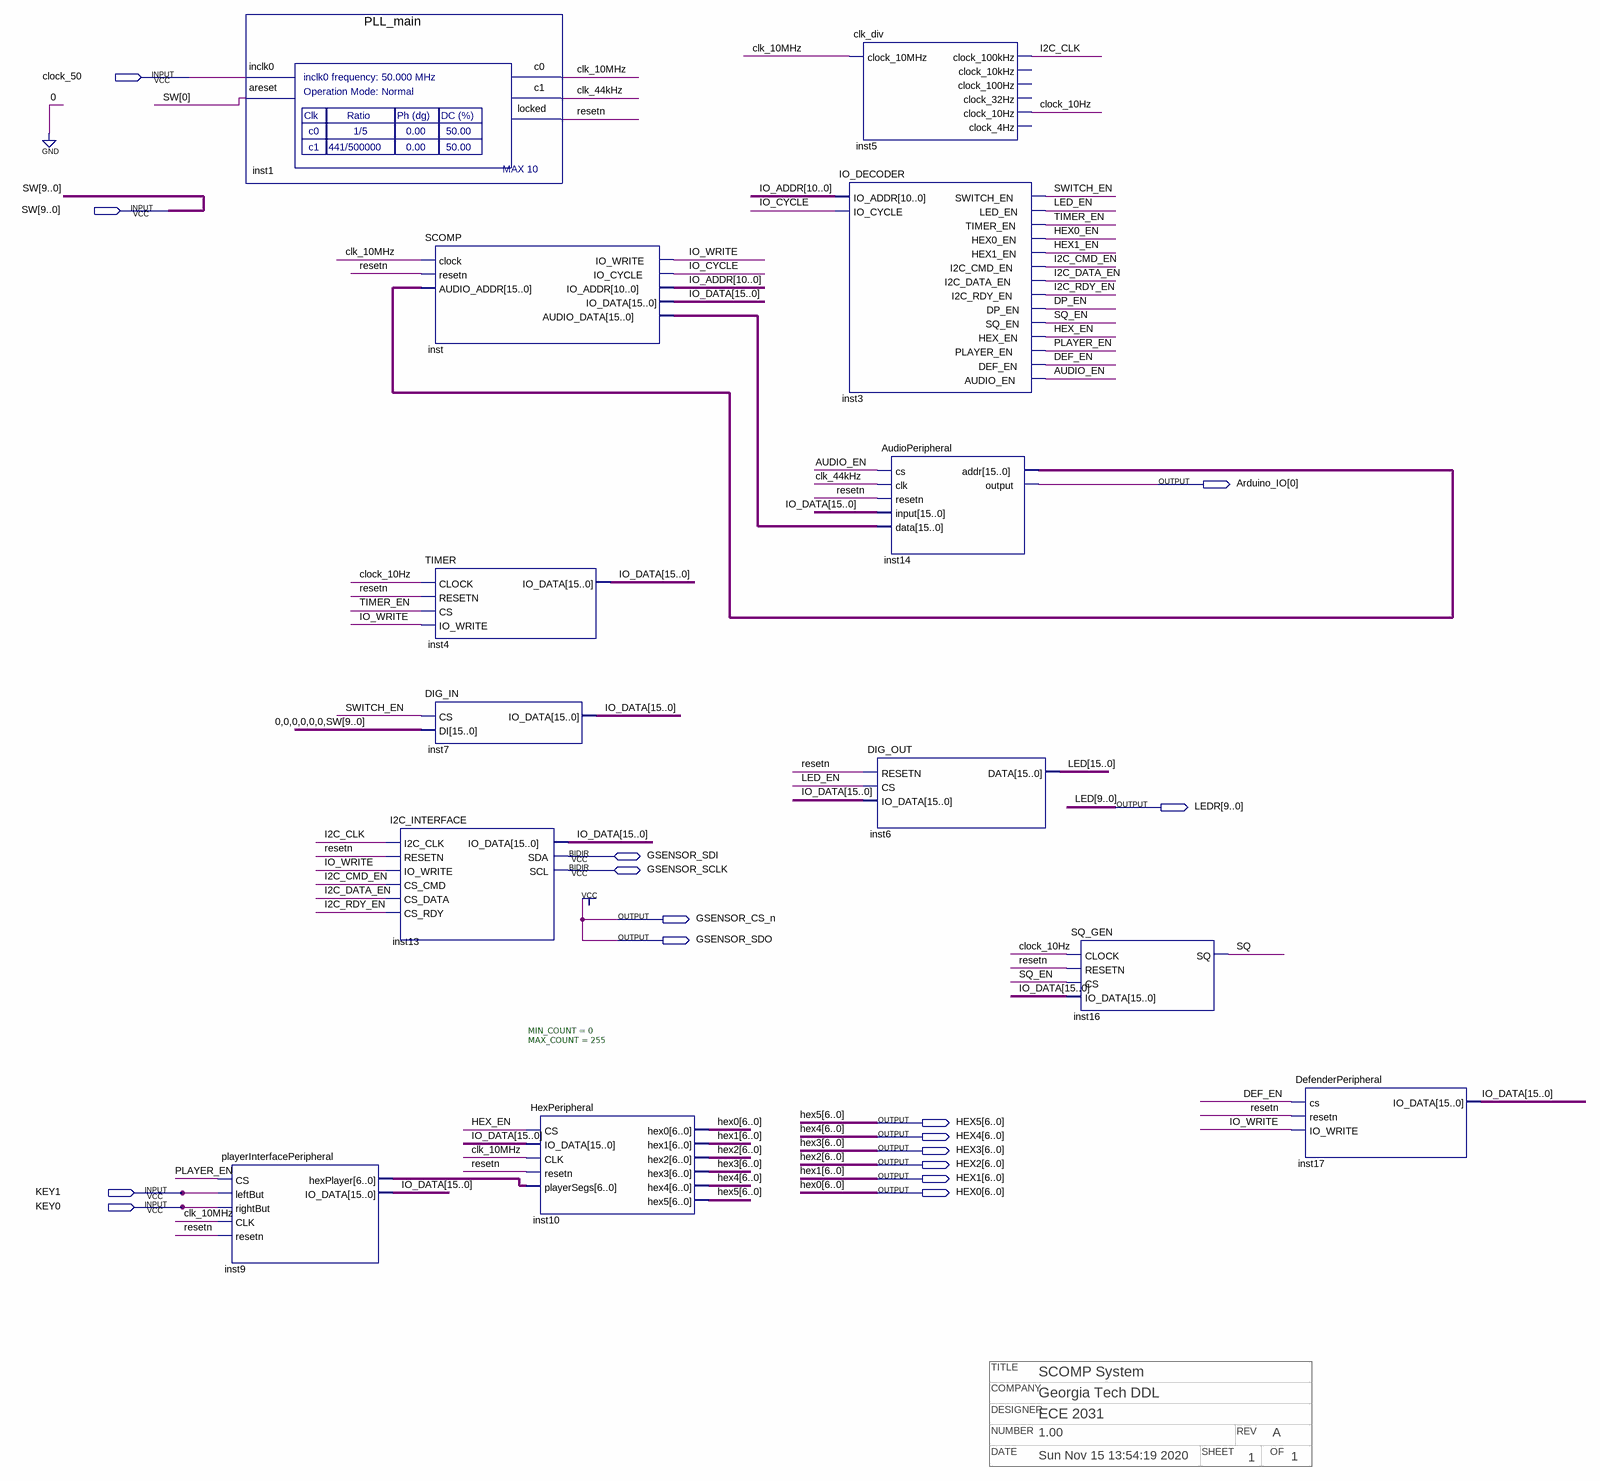
[diagram p0: schematic sheet]
// Quartus schematic SCOMP_System.bdf as structural Verilog: 13 symbols, 16 pins
// Title block: TITLE: SCOMP System; COMPANY: Georgia Tech DDL; DESIGNER: ECE 2031; NUMBER: 1.00; REV: A; DATE: Sun Nov 15 13:54:19 2020; SHEET: 1; OF: 1
module SCOMP_System (
  input  clock_50,
  input  [9:0] SW,
  input  KEY1,
  input  KEY0,
  inout  GSENSOR_SDI,
  inout  GSENSOR_SCLK,
  output [0:0] Arduino_IO,
  output [9:0] LEDR,
  output GSENSOR_CS_n,
  output GSENSOR_SDO,
  output [6:0] HEX5,
  output [6:0] HEX4,
  output [6:0] HEX3,
  output [6:0] HEX2,
  output [6:0] HEX1,
  output [6:0] HEX0
);

  wire AUDIO_EN, clk_10MHz, clk_44kHz, clock_10Hz, DEF_EN, DP_EN, HEX0_EN, HEX1_EN, HEX_EN, I2C_CLK,
       I2C_CMD_EN, I2C_DATA_EN, I2C_RDY_EN, IO_CYCLE, IO_WRITE, LED_EN, PLAYER_EN, resetn, SQ, SQ_EN,
       SWITCH_EN, TIMER_EN;
  wire [6:0] inst9_hexplayer;
  wire [10:0] IO_ADDR;
  wire [15:0] inst14_addr, inst_audio_data, IO_DATA;
  wire [15:10] LED;

  PLL_main inst1 (.inclk0(clock_50), .areset(SW[0]), .c0(clk_10MHz), .c1(clk_44kHz), .locked(resetn));
  playerInterfacePeripheral inst9 (
    .CS(PLAYER_EN), .leftBut(KEY1), .rightBut(KEY0), .CLK(clk_10MHz), .resetn(resetn),
    .hexPlayer(inst9_hexplayer), .IO_DATA(IO_DATA));
  I2C_INTERFACE inst13 (
    .I2C_CLK(I2C_CLK), .RESETN(resetn), .IO_WRITE(IO_WRITE), .CS_CMD(I2C_CMD_EN), .CS_DATA(I2C_DATA_EN),
    .CS_RDY(I2C_RDY_EN), .IO_DATA(IO_DATA), .SDA(GSENSOR_SDI), .SCL(GSENSOR_SCLK));
  SCOMP inst (
    .clock(clk_10MHz), .resetn(resetn), .AUDIO_ADDR(inst14_addr), .IO_WRITE(IO_WRITE), .IO_CYCLE(IO_CYCLE),
    .IO_ADDR(IO_ADDR), .AUDIO_DATA(inst_audio_data), .IO_DATA(IO_DATA));
  TIMER inst4 (.CLOCK(clock_10Hz), .RESETN(resetn), .CS(TIMER_EN), .IO_WRITE(IO_WRITE), .IO_DATA(IO_DATA));
  DIG_IN inst7 (.CS(SWITCH_EN), .DI({{6{1'b0}}, SW}), .IO_DATA(IO_DATA));
  HexPeripheral #(.MIN_COUNT(0), .MAX_COUNT(255)) inst10 (
    .CS(HEX_EN), .IO_DATA(IO_DATA), .CLK(clk_10MHz), .resetn(resetn), .playerSegs(inst9_hexplayer),
    .hex0(HEX0), .hex1(HEX1), .hex2(HEX2), .hex3(HEX3), .hex4(HEX4), .hex5(HEX5));
  clk_div inst5 (
    .clock_10MHz(clk_10MHz), .clock_100kHz(I2C_CLK), .clock_10Hz(clock_10Hz));  // open: clock_10kHz, clock_100Hz, clock_32Hz, clock_4Hz
  IO_DECODER inst3 (
    .IO_ADDR(IO_ADDR), .IO_CYCLE(IO_CYCLE), .SWITCH_EN(SWITCH_EN), .LED_EN(LED_EN), .TIMER_EN(TIMER_EN),
    .HEX0_EN(HEX0_EN), .HEX1_EN(HEX1_EN), .I2C_CMD_EN(I2C_CMD_EN), .I2C_DATA_EN(I2C_DATA_EN),
    .I2C_RDY_EN(I2C_RDY_EN), .DP_EN(DP_EN), .SQ_EN(SQ_EN), .HEX_EN(HEX_EN), .PLAYER_EN(PLAYER_EN),
    .DEF_EN(DEF_EN), .AUDIO_EN(AUDIO_EN));
  DIG_OUT inst6 (.RESETN(resetn), .CS(LED_EN), .IO_DATA(IO_DATA), .DATA({LED, LEDR}));
  AudioPeripheral inst14 (
    .cs(AUDIO_EN), .clk(clk_44kHz), .resetn(resetn), .\input (IO_DATA), .data(inst_audio_data),
    .addr(inst14_addr), .\output (Arduino_IO[0]));
  SQ_GEN inst16 (.CLOCK(clock_10Hz), .RESETN(resetn), .CS(SQ_EN), .IO_DATA(IO_DATA), .SQ(SQ));
  DefenderPeripheral inst17 (.cs(DEF_EN), .resetn(resetn), .IO_WRITE(IO_WRITE), .IO_DATA(IO_DATA));

  assign GSENSOR_CS_n = 1'b1;
  assign GSENSOR_SDO = 1'b1;

  // Other names for the same wires on the sheet: LED[9:0] = LEDR
endmodule
